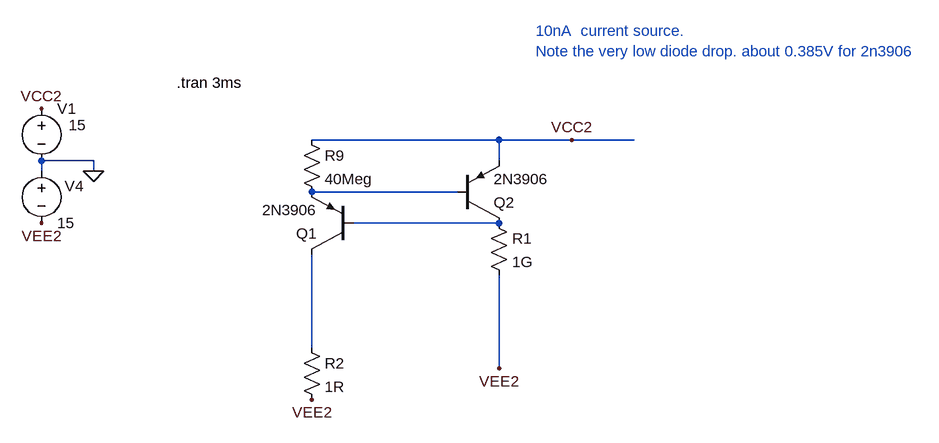
[diagram p0: schematic Draft58.asc]
Draft58.asc, the LTspice schematic file:
Version 4
SHEET 1 2428 952
WIRE 304 -320 16 -320
WIRE 416 -320 304 -320
WIRE 512 -320 416 -320
WIRE -320 -288 -400 -288
WIRE 304 -288 304 -320
WIRE -400 -272 -400 -288
WIRE -320 -272 -320 -288
WIRE 240 -240 16 -240
WIRE 304 -192 80 -192
WIRE 16 0 16 -144
WIRE 304 32 304 -112
FLAG -320 -272 0
FLAG -400 -368 VCC2
FLAG -400 -192 VEE2
FLAG 416 -320 VCC2
FLAG 304 32 VEE2
FLAG 16 80 VEE2
SYMBOL voltage -400 -384 R0
WINDOW 123 0 0 Left 0
WINDOW 39 0 0 Left 0
WINDOW 3 42 41 Left 2
SYMATTR Value 15
SYMATTR InstName V1
SYMBOL voltage -400 -288 R0
WINDOW 123 0 0 Left 0
WINDOW 39 0 0 Left 0
WINDOW 0 36 39 Left 2
SYMATTR InstName V4
SYMATTR Value 15
SYMBOL res 0 -336 R0
SYMATTR InstName R9
SYMATTR Value 40Meg
SYMBOL pnp 80 -144 R180
SYMATTR InstName Q1
SYMATTR Value 2N3906
SYMBOL pnp 240 -192 M180
SYMATTR InstName Q2
SYMATTR Value 2N3906
SYMBOL res 288 -208 R0
SYMATTR InstName R1
SYMATTR Value 1G
SYMBOL res 0 -16 R0
SYMATTR InstName R2
SYMATTR Value 1R
TEXT -192 -408 Left 2 !.tran 3ms
TEXT 360 -488 Left 2 ;10nA  current source.\nNote the very low diode drop. about 0.385V for 2n3906

The netlist it stands for:
* Draft58.asc
V1 VCC2 0 15
V4 0 VEE2 15
R9 VCC2 N001 40Meg
Q1 N003 N002 N001 0 2N3906
Q2 N002 N001 VCC2 0 2N3906
R1 N002 VEE2 1G
R2 N003 VEE2 1R
.model NPN NPN
.model PNP PNP
.lib standard.bjt
.tran 3ms
* 10nA  current source.
* Note the very low diode drop. about 0.385V for 2n3906
.backanno
.end